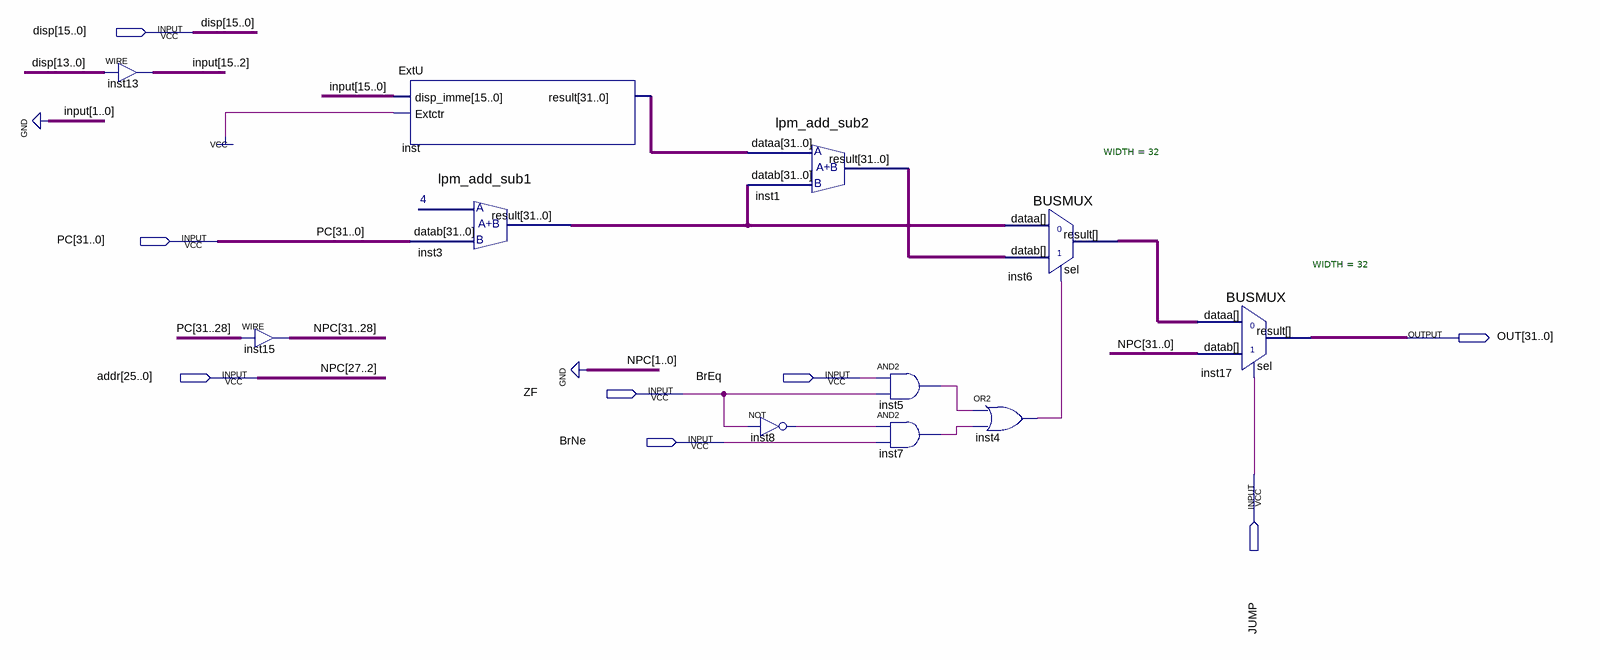
[diagram p0: schematic sheet]
// Quartus schematic ACU.bdf as structural Verilog: 11 symbols, 8 pins
module ACU (
  input  [15:0] disp,
  input  [31:0] PC,
  input  [25:0] addr,
  input  BrEq,
  input  ZF,
  input  BrNe,
  input  JUMP,
  output [31:0] OUT
);

  wire inst4_out, inst5_out, inst7_out, inst8_out;
  wire [15:2] \input ;
  wire [31:0] inst1_result, inst3_result, inst6_result, inst_result;
  wire [31:28] NPC;

  assign \input  = disp[13:0];  // WIRE inst13
  assign NPC = PC[31:28];  // WIRE inst15
  ExtU inst (.disp_imme({\input , 2'b00}), .Extctr(1'b1), .result(inst_result));
  lpm_add_sub1 inst3 (.datab(PC), .result(inst3_result));
  lpm_add_sub2 inst1 (.dataa(inst_result), .datab(inst3_result), .result(inst1_result));
  not inst8 (inst8_out, ZF);
  and inst5 (inst5_out, BrEq, ZF);
  and inst7 (inst7_out, inst8_out, BrNe);
  or inst4 (inst4_out, inst5_out, inst7_out);
  BUSMUX #(.WIDTH(32)) inst6 (.datab(inst1_result), .sel(inst4_out), .dataa(inst3_result), .result(inst6_result));
  BUSMUX #(.WIDTH(32)) inst17 (.datab({NPC, addr, 2'b00}), .sel(JUMP), .dataa(inst6_result), .result(OUT));

  // Other names for the same wires on the sheet: NPC[27:2] = addr
endmodule
